# Altium schematic sheet Part_2_PS_Controller.SchDoc
size A; SheetNumber: 2; SheetTotal: 2
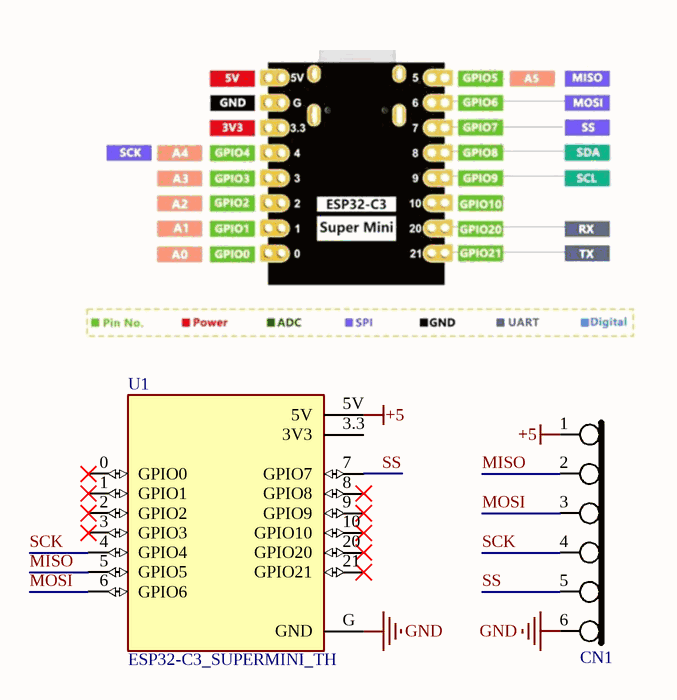
[diagram p0: Part_2_PS_Controller.SchDoc]

## Parts
CN1  CN_6P_Header 1 Row  [HD6-2.54]  (value not drawn)
U1  ESP32-C3_SUPERMINI_TH  [MODULE_ESP32-C3_SUPERMINI_TH]

## Nets
+5: CN1.1 U1.5V
GND: CN1.6 U1.G(GND)
MISO: CN1.2 U1.5(GPIO5)
MOSI: CN1.3 U1.6(GPIO6)
SCK: CN1.4 U1.4(GPIO4)
SS: CN1.5 U1.7(GPIO7)

Not connected (* = marked no-connect by the designer): U1 0(GPIO0)* 1(GPIO1)* 2(GPIO2)* 3(GPIO3)* 3.3(3V3) 8(GPIO8)* 9(GPIO9)* 10(GPIO10)* 20(GPIO20)* 21(GPIO21)*

## Library data of the parts
CN1 = CN_6P_Header 1 Row: Jump Header 6P 1Row; 3.Part Name: Male Header 6P; 1.Type: Through Hole; 2.Category: Connector; 4.Value: Connector 6
U1 = ESP32-C3_SUPERMINI_TH: Super tiny ESP32-C3 board; MF: Espressif Systems; MP: ESP32-C3 SuperMini_TH; SnapEDA_Link: https://www.snapeda.com/parts/ESP32-C3%20SuperMini_TH/Espressif+Systems/view-part/?ref=snap; Package: Package; Value: *; Check_prices: https://www.snapeda.com/parts/ESP32-C3%20SuperMini_TH/Espressif+Systems/view-part/?ref=eda